# Altium schematic sheet 0248_GPU SPI FLASH CIRC.SchDoc
size 848 x 558 mm
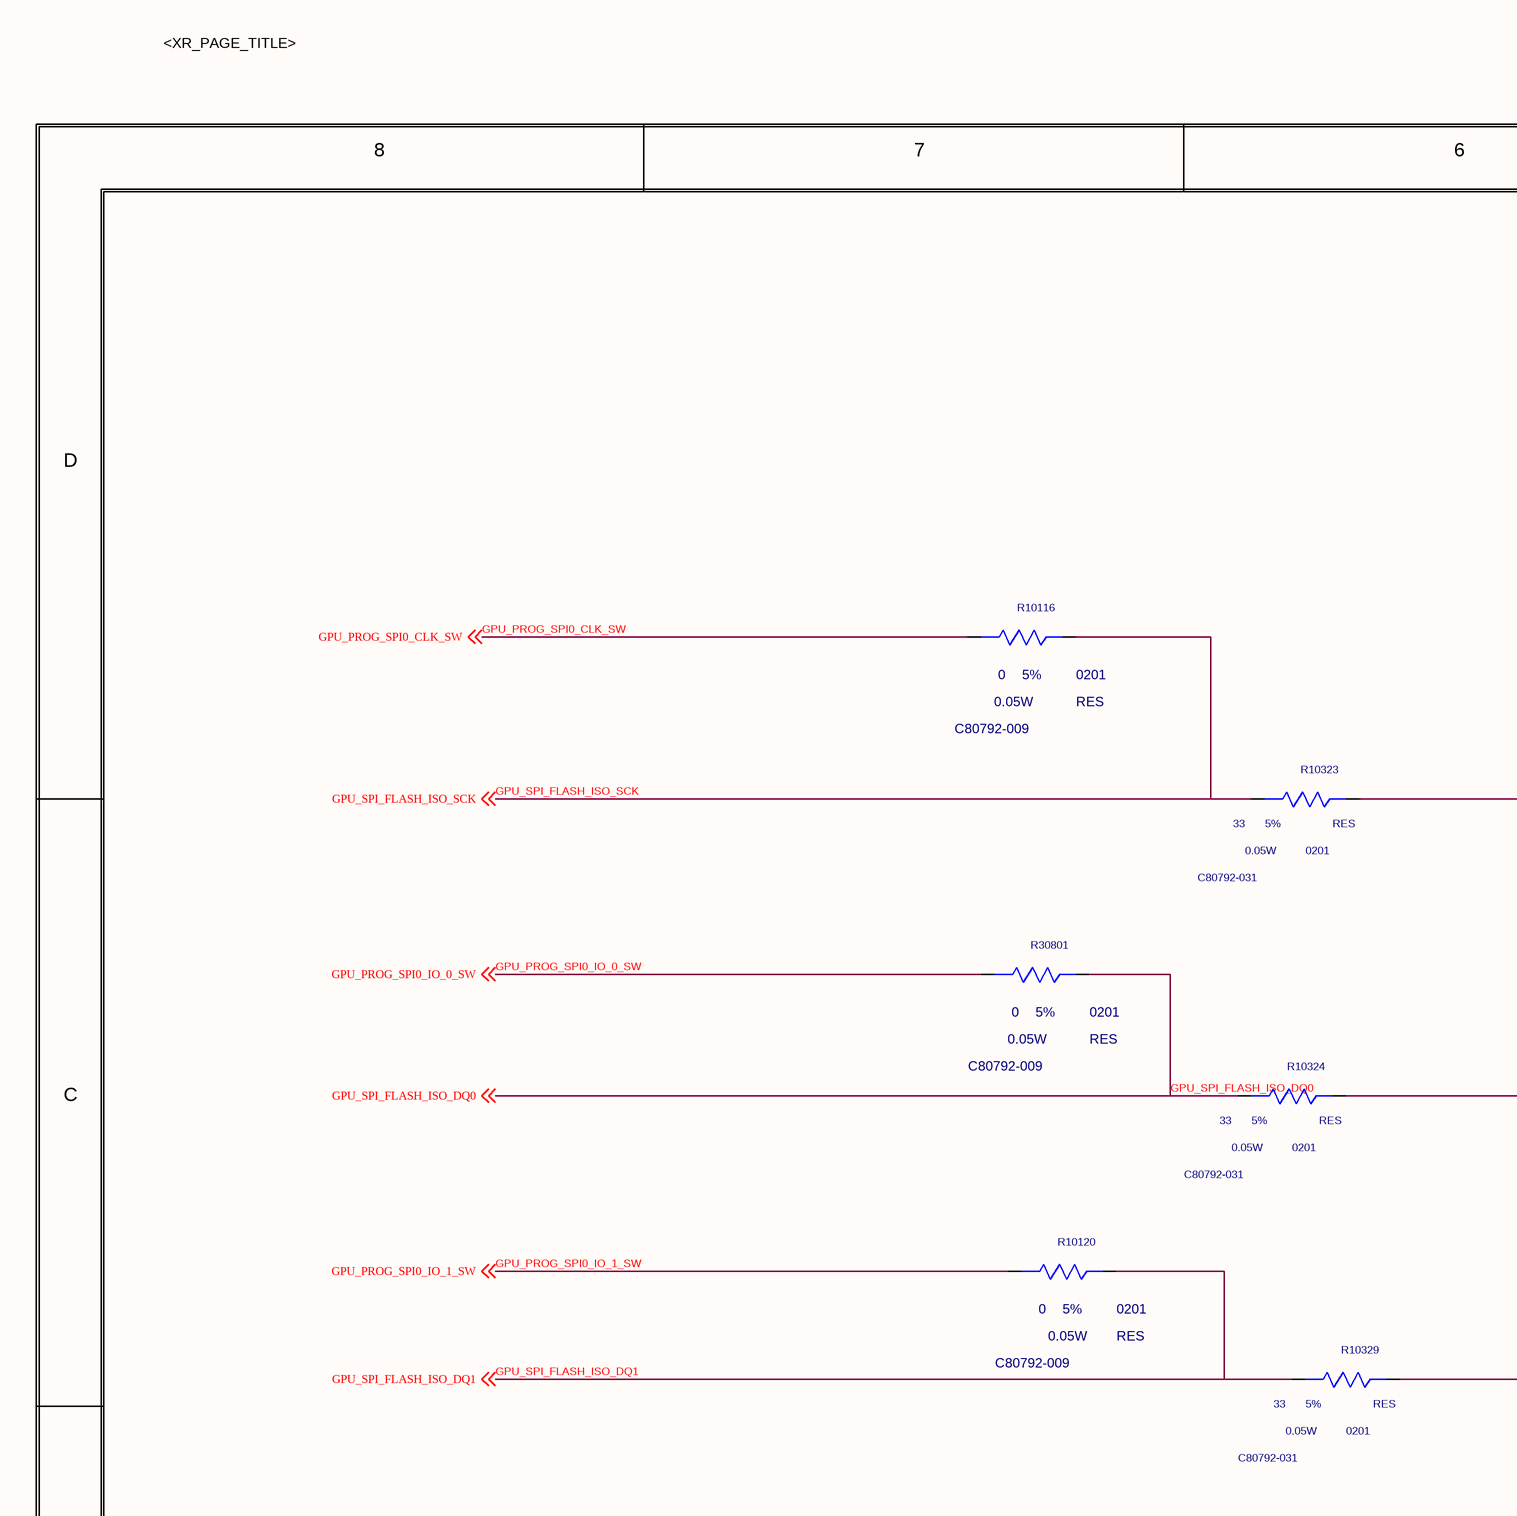
[diagram p0: 0248_GPU SPI FLASH CIRC.SchDoc, top left]
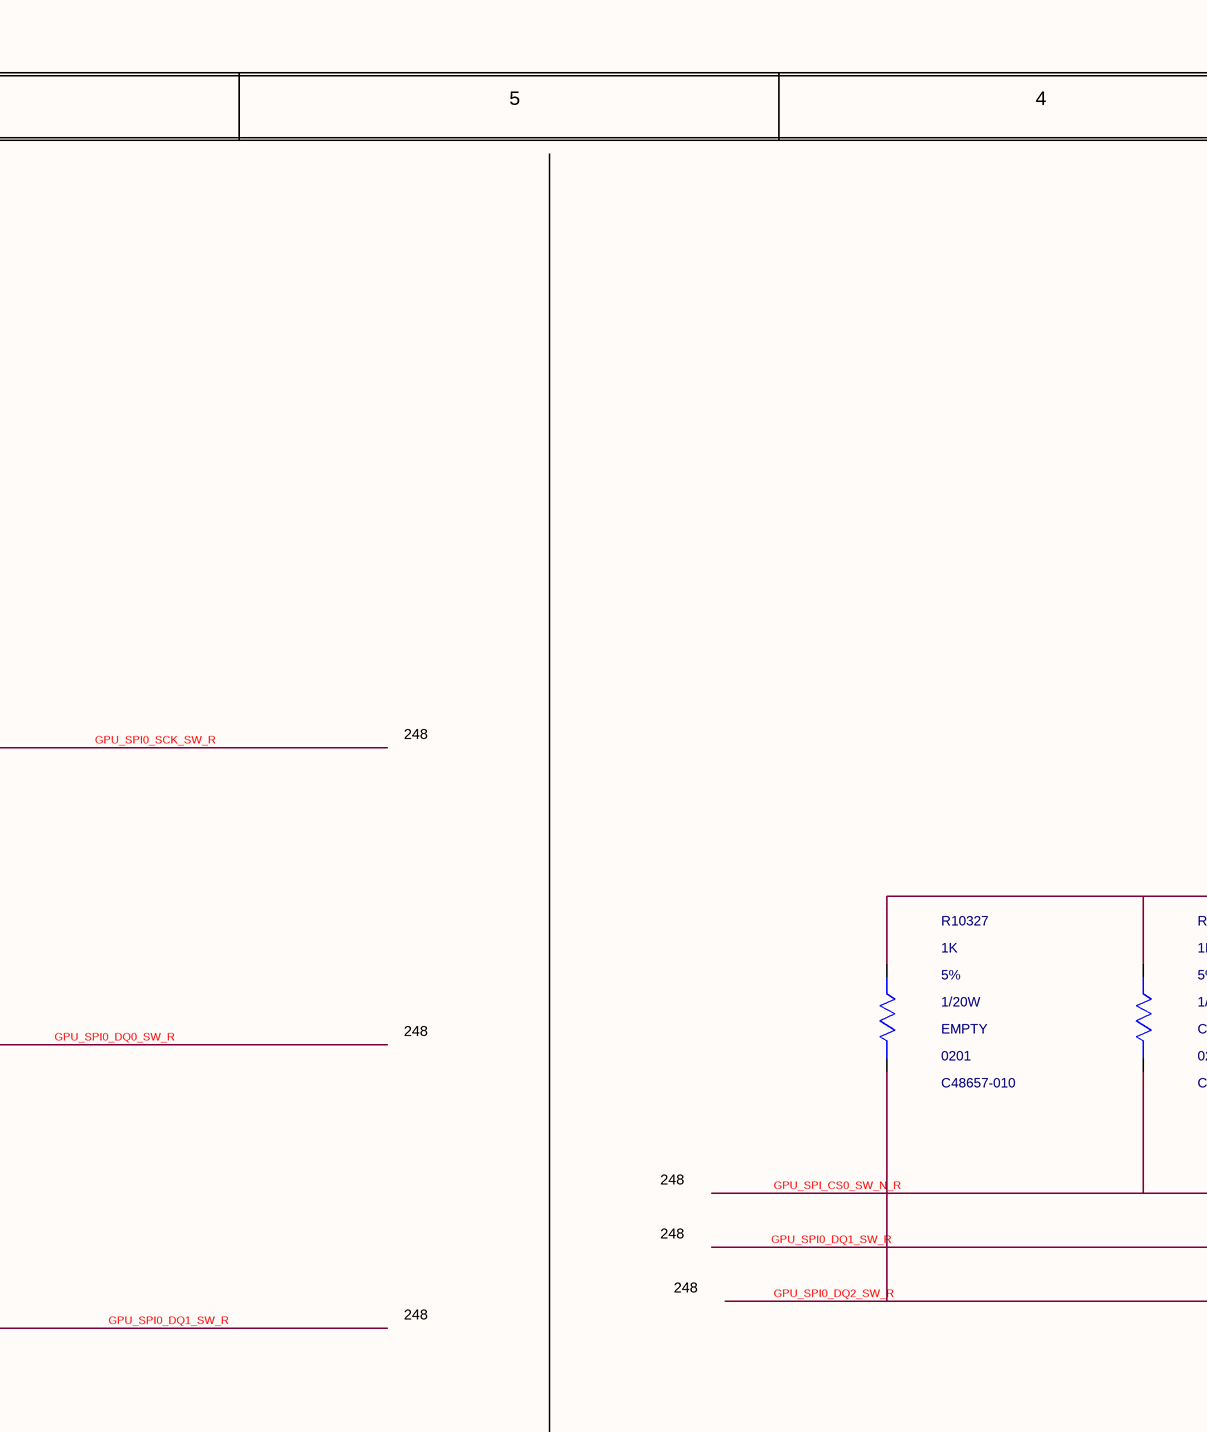
[diagram p1: 0248_GPU SPI FLASH CIRC.SchDoc, top middle]
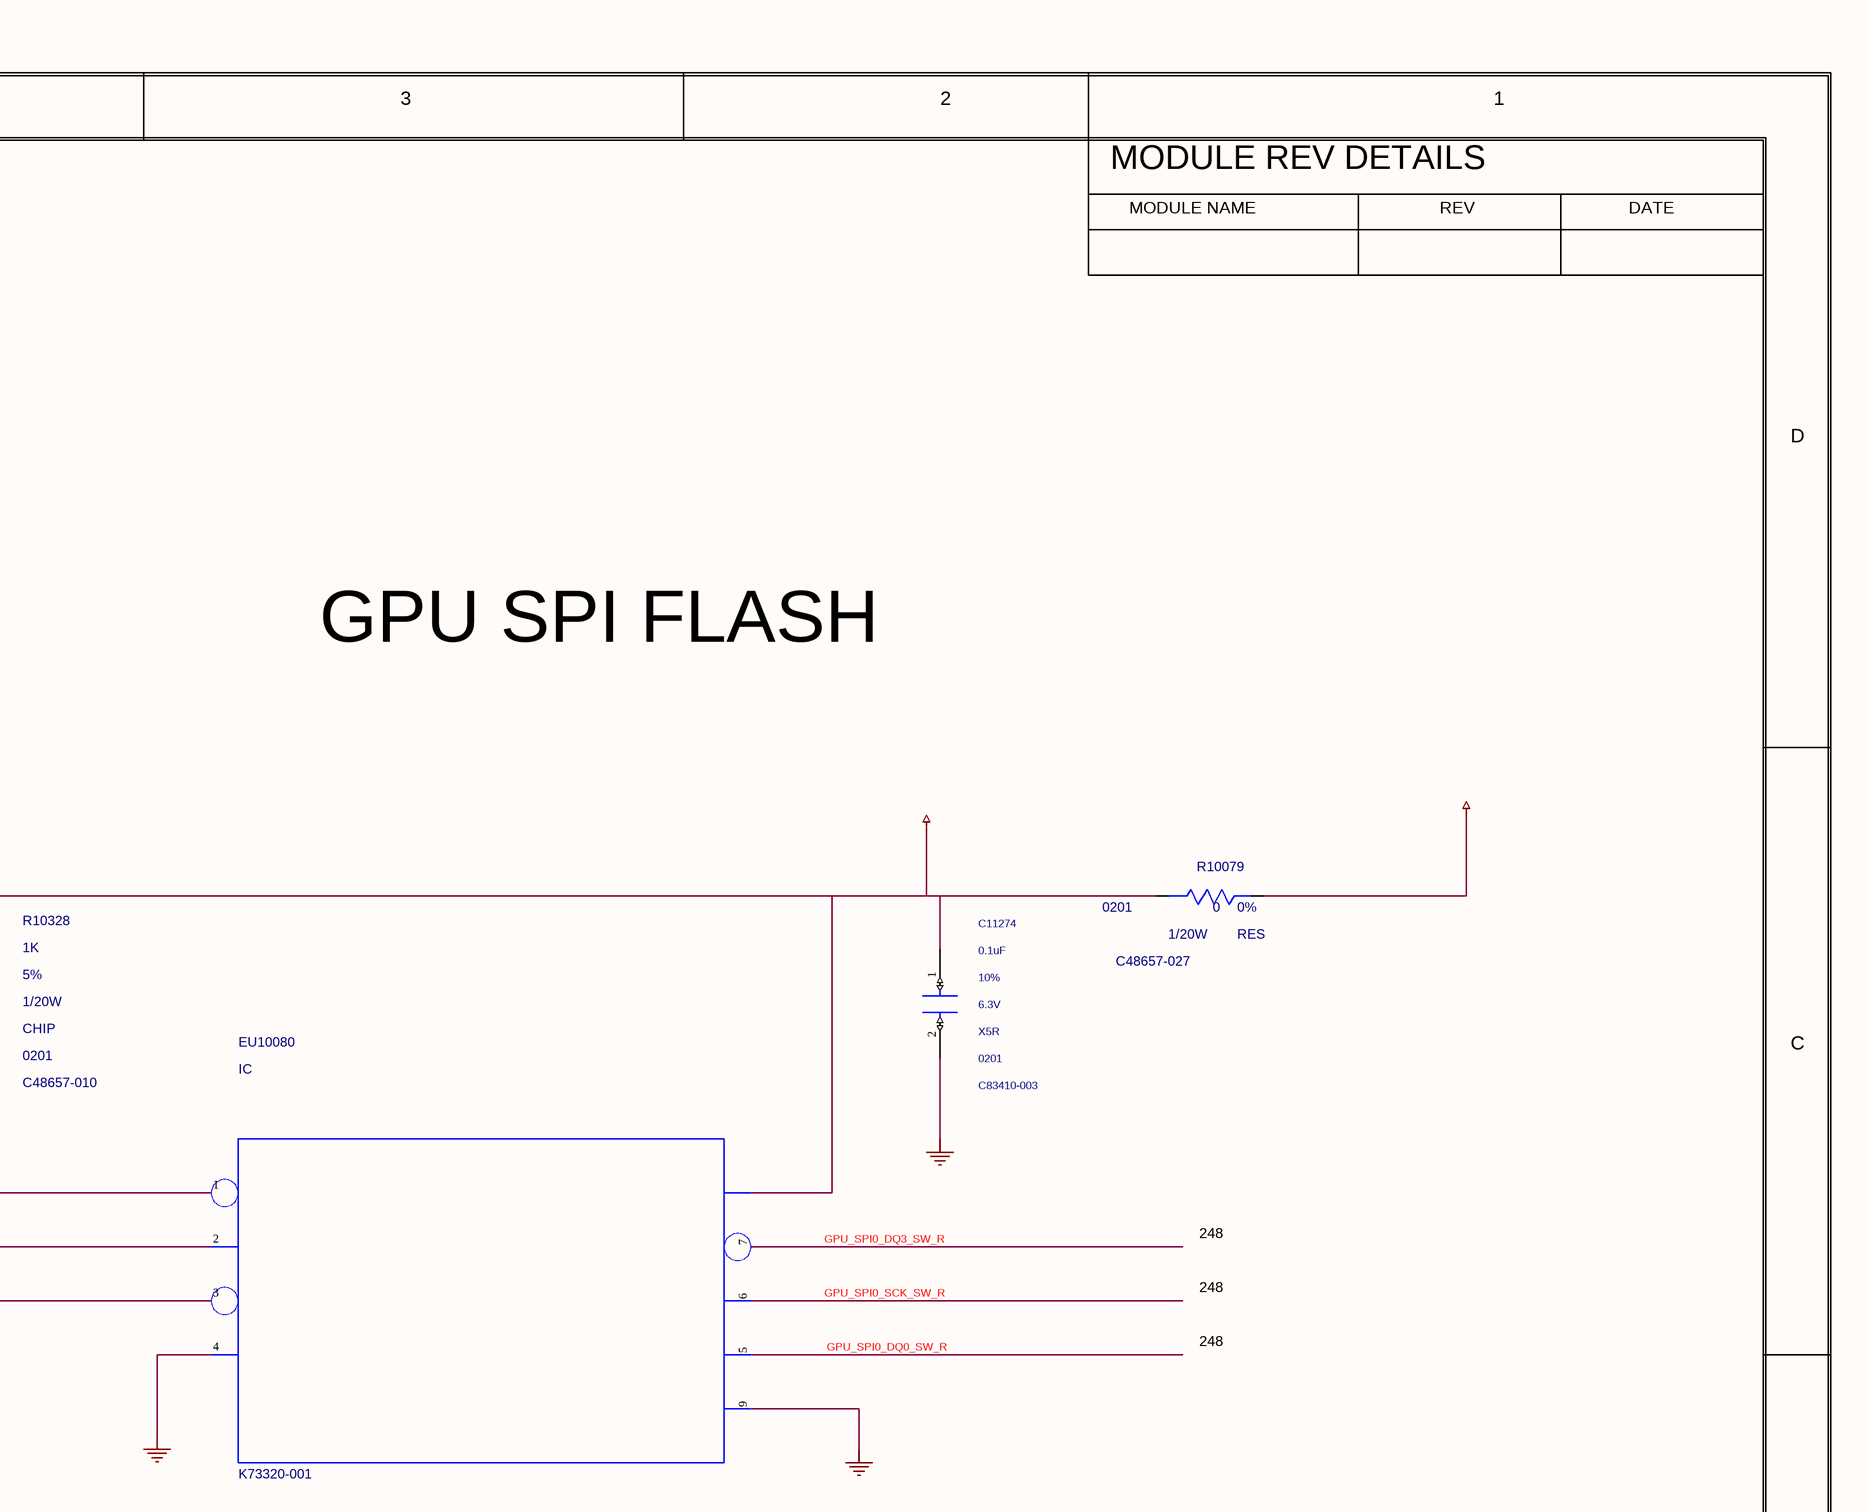
[diagram p2: 0248_GPU SPI FLASH CIRC.SchDoc, top right]
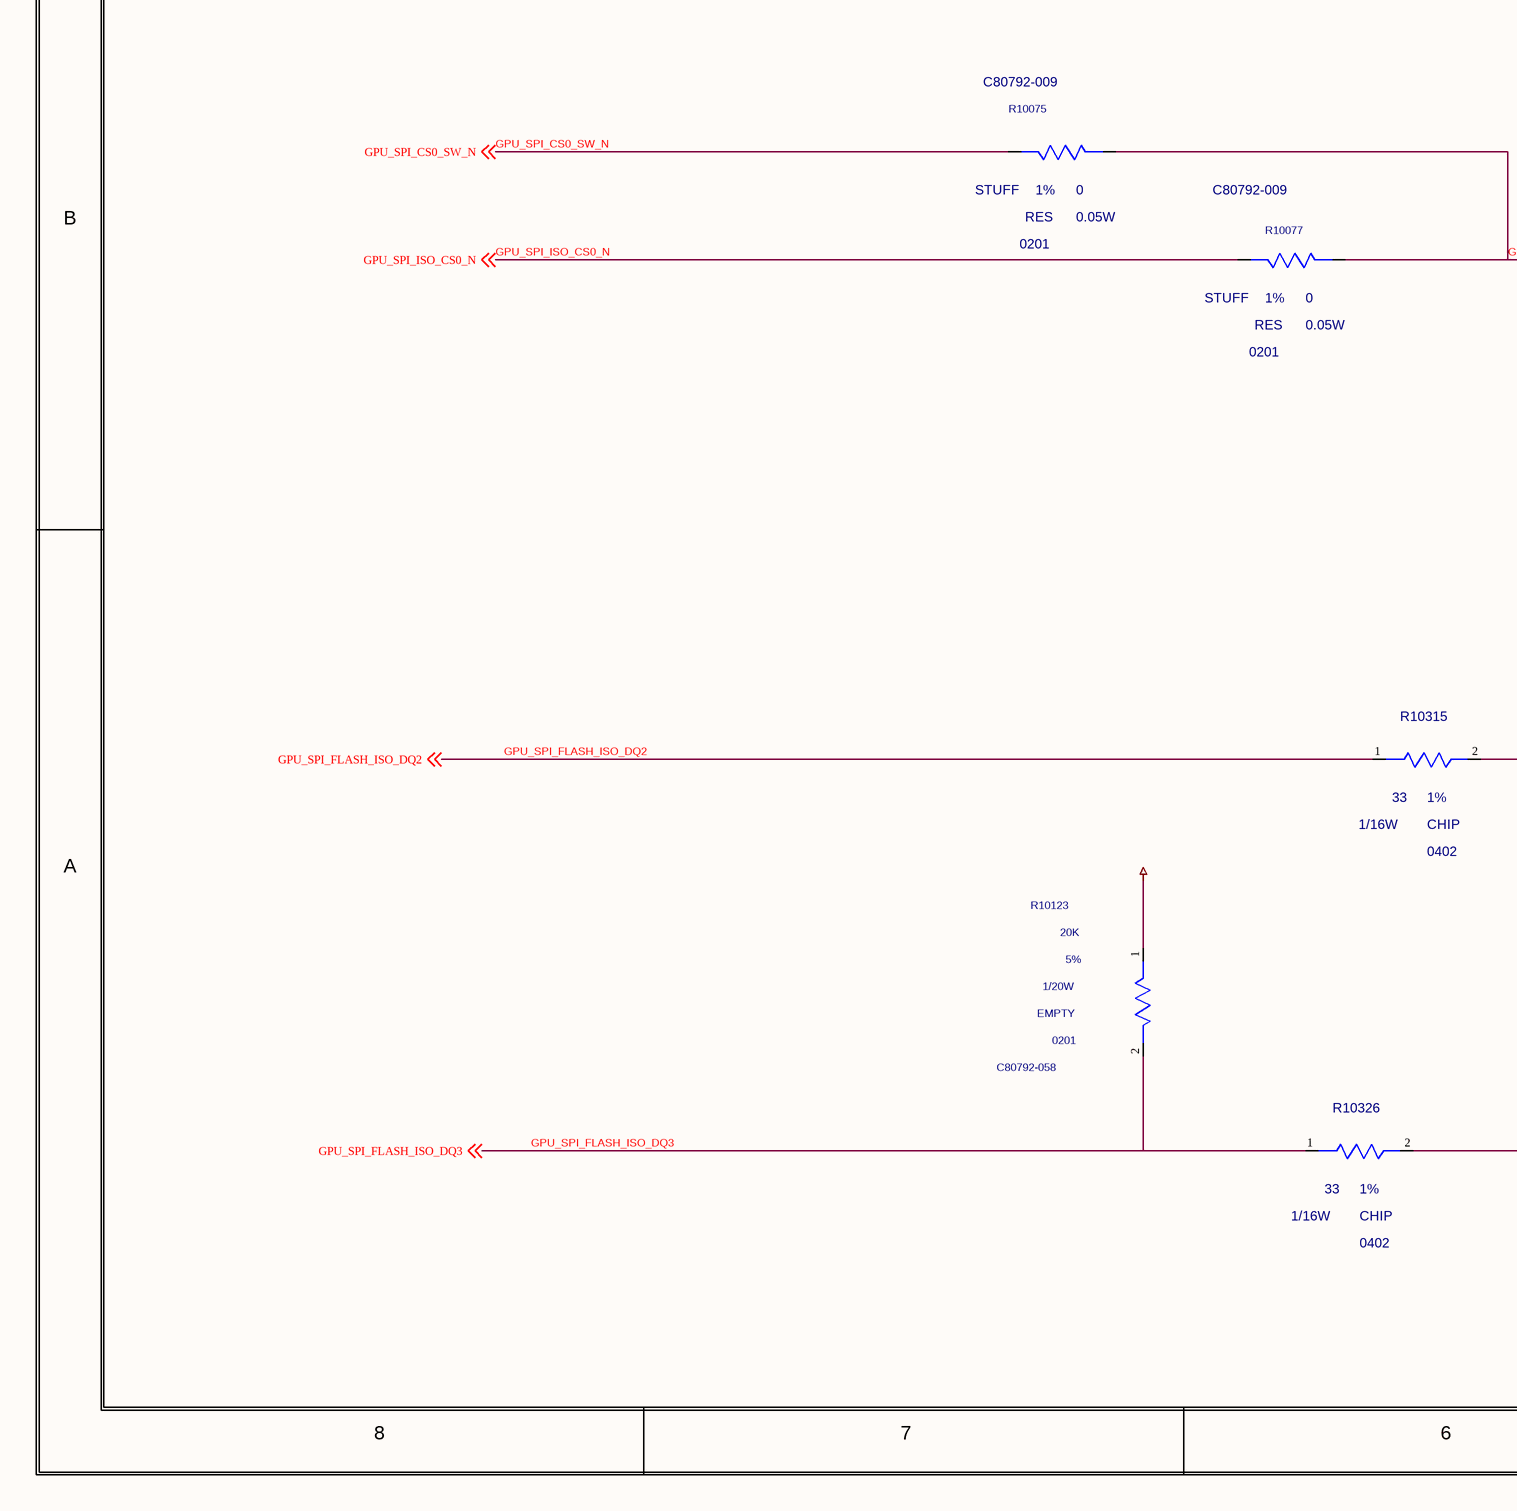
[diagram p3: 0248_GPU SPI FLASH CIRC.SchDoc, bottom left]
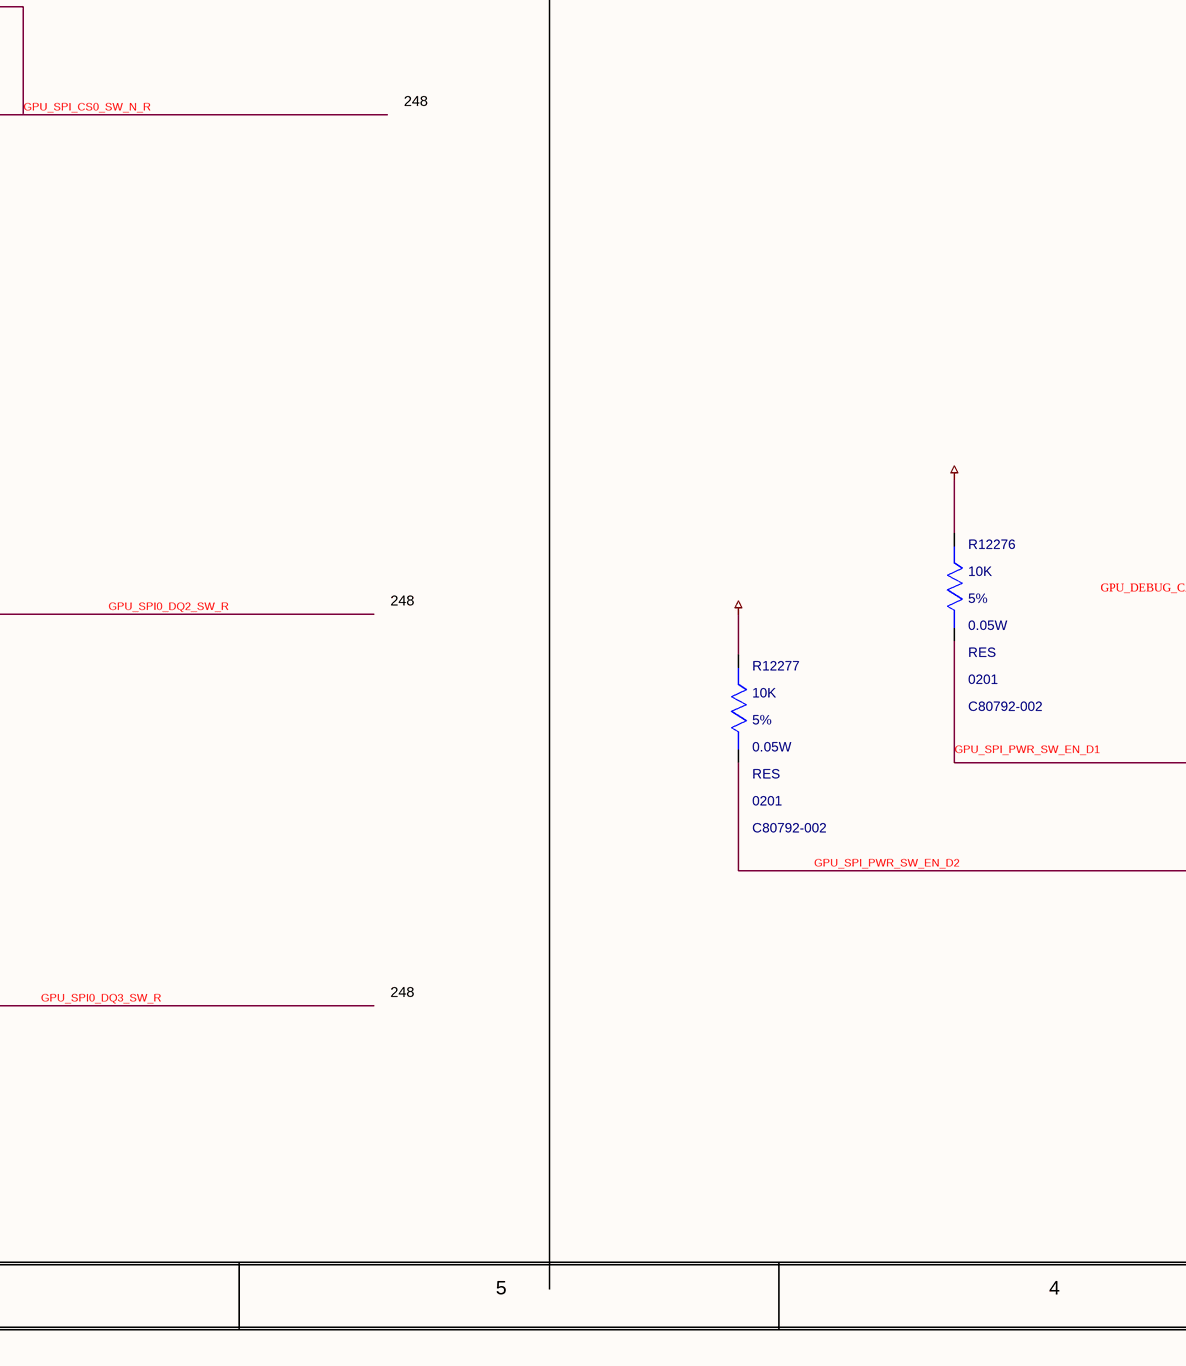
[diagram p4: 0248_GPU SPI FLASH CIRC.SchDoc, bottom middle]
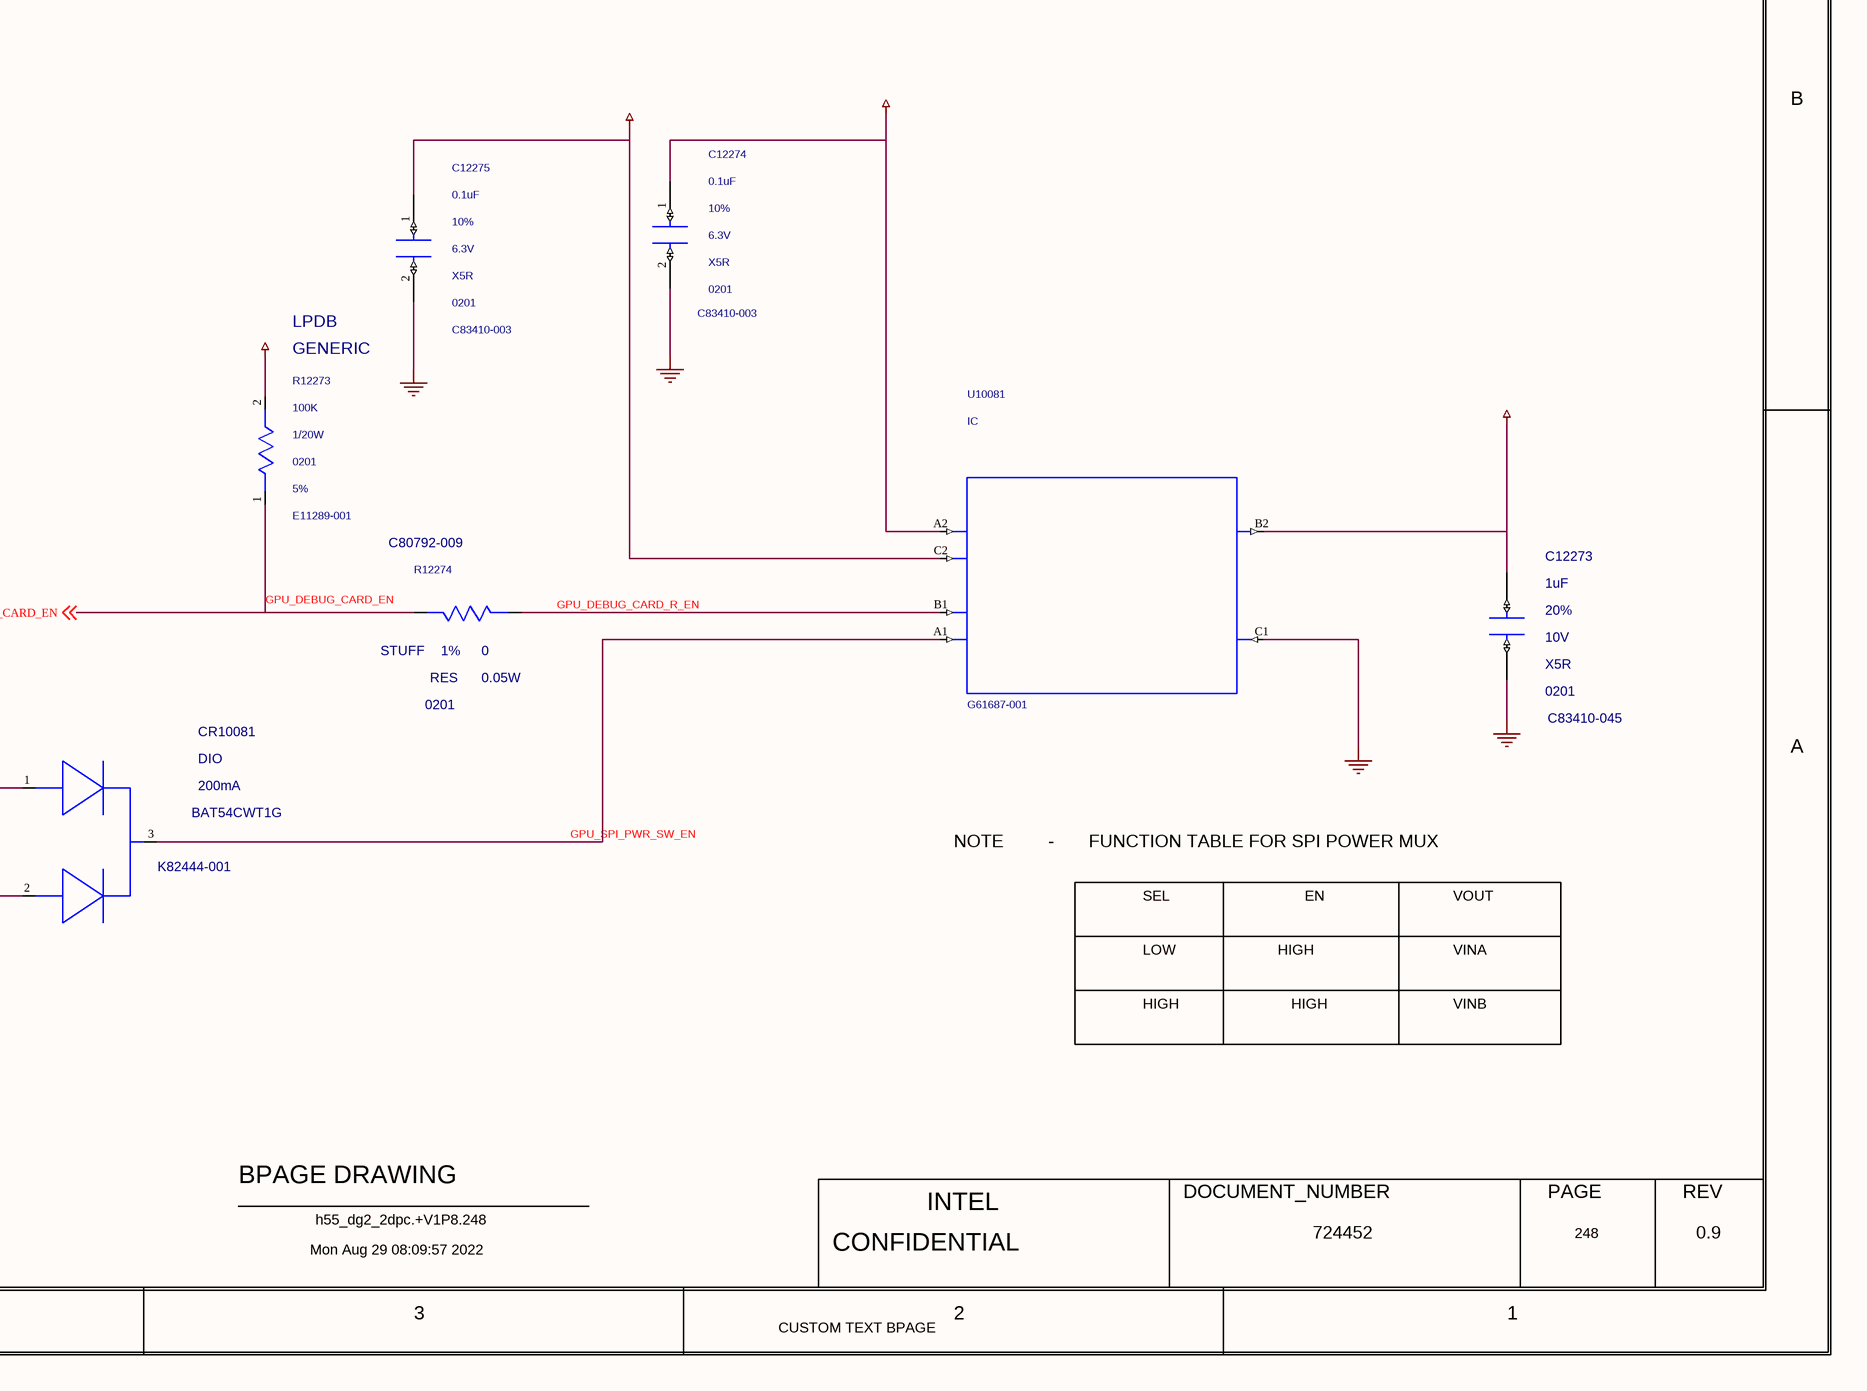
[diagram p5: 0248_GPU SPI FLASH CIRC.SchDoc, bottom right]

## Parts
C11274  0.1uF  MATERIAL: X5R  PACK_TYPE: 0201  PART_NUMBER: C83410-003  TOLERANCE: 10%  VOLTAGE: 6.3V  [SMC0201IA]
C12273  1uF  MATERIAL: X5R  PACK_TYPE: 0201  PART_NUMBER: C83410-045  TOLERANCE: 20%  VOLTAGE: 10V  [TK0_SM0201_690X390_MA]
C12274  0.1uF  MATERIAL: X5R  PACK_TYPE: 0201  PART_NUMBER: C83410-003  TOLERANCE: 10%  VOLTAGE: 6.3V  [SMC0201IA]
C12275  0.1uF  MATERIAL: X5R  PACK_TYPE: 0201  PART_NUMBER: C83410-003  TOLERANCE: 10%  VOLTAGE: 6.3V  [SMC0201IA]
CR10081  BAT54CWT1G  CURRENT: 200mA  MATERIAL: DIO  PART_NUMBER: K82444-001  [TK0_SOT323_3_1350X2200_650_MB]
EU10080  MATERIAL: IC  PART_NUMBER: K73320-001  [TK0_LCC8_6100X5100_1270_DF3400X4300_MC]  (hidden comment: W25Q64JW_2)
R10075  0  BOM_USE: STUFF  MATERIAL: RES  PACK_TYPE: 0201  PART_NUMBER: C80792-009  TOLERANCE: 1%  WATTAGE: 0.05W  [TK0_SM0201_630X330_MC]
R10077  0  BOM_USE: STUFF  MATERIAL: RES  PACK_TYPE: 0201  PART_NUMBER: C80792-009  TOLERANCE: 1%  WATTAGE: 0.05W  [TK0_SM0201_630X330_MC]
R10079  0  MATERIAL: RES  PACK_TYPE: 0201  PART_NUMBER: C48657-027  TOLERANCE: 0%  WATTAGE: 1/20W  [TK0_SM0201_630X330_MB]
R10116  0  MATERIAL: RES  PACK_TYPE: 0201  PART_NUMBER: C80792-009  TOLERANCE: 5%  WATTAGE: 0.05W  [CTK0_SM0201_630X330_MA]
R10120  0  MATERIAL: RES  PACK_TYPE: 0201  PART_NUMBER: C80792-009  TOLERANCE: 5%  WATTAGE: 0.05W  [CTK0_SM0201_630X330_MA]
R10123  20K  MATERIAL: EMPTY  PACK_TYPE: 0201  PART_NUMBER: C80792-058  TOLERANCE: 5%  WATTAGE: 1/20W  [SMR0201IA]
R10315  33  MATERIAL: CHIP  PACK_TYPE: 0402  TOLERANCE: 1%  WATTAGE: 1/16W  [SMR0402IA]
R10323  33  MATERIAL: RES  PACK_TYPE: 0201  PART_NUMBER: C80792-031  TOLERANCE: 5%  WATTAGE: 0.05W  [CTK0_SM0201_630X330_MA]
R10324  33  MATERIAL: RES  PACK_TYPE: 0201  PART_NUMBER: C80792-031  TOLERANCE: 5%  WATTAGE: 0.05W  [CTK0_SM0201_630X330_MA]
R10326  33  MATERIAL: CHIP  PACK_TYPE: 0402  TOLERANCE: 1%  WATTAGE: 1/16W  [SMR0402IA]
R10327  1K  MATERIAL: EMPTY  PACK_TYPE: 0201  PART_NUMBER: C48657-010  TOLERANCE: 5%  WATTAGE: 1/20W  [TK2_SM0201_630X330_MA]
R10328  1K  MATERIAL: CHIP  PACK_TYPE: 0201  PART_NUMBER: C48657-010  TOLERANCE: 5%  WATTAGE: 1/20W  [TK2_SM0201_630X330_MA]
R10329  33  MATERIAL: RES  PACK_TYPE: 0201  PART_NUMBER: C80792-031  TOLERANCE: 5%  WATTAGE: 0.05W  [CTK0_SM0201_630X330_MA]
R12273  100K  PACK_TYPE: 0201  PART_NUMBER: E11289-001  TOLERANCE: 5%  WATTAGE: 1/20W  IP: GENERIC  FP_TECH: LPDB  [SMR0201IA]
R12274  0  BOM_USE: STUFF  MATERIAL: RES  PACK_TYPE: 0201  PART_NUMBER: C80792-009  TOLERANCE: 1%  WATTAGE: 0.05W  [TK0_SM0201_630X330_MC]
R12276  10K  MATERIAL: RES  PACK_TYPE: 0201  PART_NUMBER: C80792-002  TOLERANCE: 5%  WATTAGE: 0.05W  [TK0_SM0201_630X330_ME]
R12277  10K  MATERIAL: RES  PACK_TYPE: 0201  PART_NUMBER: C80792-002  TOLERANCE: 5%  WATTAGE: 0.05W  [TK0_SM0201_630X330_ME]
R30801  0  MATERIAL: RES  PACK_TYPE: 0201  PART_NUMBER: C80792-009  TOLERANCE: 5%  WATTAGE: 0.05W  [CTK0_SM0201_630X330_MA]
U10081  MATERIAL: IC  PART_NUMBER: G61687-001  [BGA6_1_50MC]  (hidden comment: FPF1320)

## Nets
+V1P8A_SPI: C12273.1(A) R10079.2(B) U10081.B2(VOUT)
+V1P8A_SPI_FLASH_GPU: C11274.1(A) R10079.1(A) R10123.1(A) R10327.1(A) R10328.1(A)
+V1P8S_GPU: C12275.1(A) R12273.2(B) R12276.1(A) U10081.C2(VINB)
+VPROG_1P8A_CONN_GPU: C12274.1(A) R12277.1(A) U10081.A2(VINA)
GND: C11274.2(B) C12273.2(B) C12274.2(B) C12275.2(B) EU10080.4(GND) EU10080.9(THPAD) U10081.C1(GND)
VCC: EU10080.8(VCC)
GPU_DEBUG_CARD_EN: R12273.1(A) R12274.2(B) ; off-sheet GPU_DEBUG_CARD_EN
GPU_DEBUG_CARD_R_EN: R12274.1(A) U10081.B1(SEL)
GPU_PROG_SPI0_CLK_SW: R10116.1(A) ; off-sheet GPU_PROG_SPI0_CLK_SW
GPU_PROG_SPI0_IO_0_SW: R30801.1(A) ; off-sheet GPU_PROG_SPI0_IO_0_SW
GPU_PROG_SPI0_IO_1_SW: R10120.1(A) ; off-sheet GPU_PROG_SPI0_IO_1_SW
GPU_SPI0_DQ0_SW_R: EU10080.5(DI_IO0) R10324.2(B)
GPU_SPI0_DQ1_SW_R: EU10080.2(DO_IO1) R10329.2(B)
GPU_SPI0_DQ2_SW_R: EU10080.3(WP_N_IO2) R10315.2(B) R10327.2(B)
GPU_SPI0_DQ3_SW_R: EU10080.7(HOLD_N_RESET_N_IO3) R10326.2(B)
GPU_SPI0_SCK_SW_R: EU10080.6(CLK) R10323.2(B)
GPU_SPI_CS0_SW_N: R10075.2(B) ; off-sheet GPU_SPI_CS0_SW_N
GPU_SPI_CS0_SW_N_R: EU10080.1(CS_N) R10075.1(A) R10077.1(A) R10328.2(B)
GPU_SPI_FLASH_ISO_DQ0: R10324.1(A) R30801.2(B) ; off-sheet GPU_SPI_FLASH_ISO_DQ0
GPU_SPI_FLASH_ISO_DQ1: R10120.2(B) R10329.1(A) ; off-sheet GPU_SPI_FLASH_ISO_DQ1
GPU_SPI_FLASH_ISO_DQ2: R10315.1(A) ; off-sheet GPU_SPI_FLASH_ISO_DQ2
GPU_SPI_FLASH_ISO_DQ3: R10123.2(B) R10326.1(A) ; off-sheet GPU_SPI_FLASH_ISO_DQ3
GPU_SPI_FLASH_ISO_SCK: R10116.2(B) R10323.1(A) ; off-sheet GPU_SPI_FLASH_ISO_SCK
GPU_SPI_ISO_CS0_N: R10077.2(B) ; off-sheet GPU_SPI_ISO_CS0_N
GPU_SPI_PWR_SW_EN: CR10081.3(C) U10081.A1(EN)
GPU_SPI_PWR_SW_EN_D1: CR10081.1(A1) R12276.2(B)
GPU_SPI_PWR_SW_EN_D2: CR10081.2(A2) R12277.2(B)

## Notes on the sheet
- <XR_PAGE_TITLE>
- 8
- 7
- 6
- 5
- 4
- 3
- 2
- 1
- MODULE REV DETAILS
- MODULE NAME
- REV
- DATE
- D
- GPU SPI FLASH
- 248
- C
- B
- A
- NOTE
- -
- FUNCTION TABLE FOR SPI POWER MUX
- SEL
- EN
- VOUT
- HIGH
- LOW
- VINA
- VINB
- BPAGE DRAWING
- INTEL
- DOCUMENT_NUMBER
- PAGE
- Mon Aug 29 08:09:57 2022
- h55_dg2_2dpc.+V1P8.248
- CONFIDENTIAL
- 724452
- 0.9
- CUSTOM TEXT BPAGE

## Library data of the parts
C11274 = CAP: CDS_PHYS_PART_NAME: CAP_0201-C83410-003,X5R,0.1UF,6.3V,10%,LPDB,GENERIC; OriginalSymbolOrigin: (-50,25); XY: (-8425,3300); VER: 1; ROT: 0; PHYS_PAGE: 248; LOCATION: C11274; DRAWING: @RVP1_ADL_SB_ADP_S_DDR5_SODIMM_2DPC_LIB.H55_DG2_2DPC(SCH_1):PAGE448; CDS_LIB: discrete; PCB Footprint: SMC0201IA; CHIPS_PART_NAME: CAP; CDS_PART_NAME: CAP_0201-C83410-003,X5R,0.1UF,6.3V,10%,LPDB,GENERIC; CDS_LOCATION: C11274
C12273 = CAP_2: CDS_PHYS_PART_NAME: CAP_2_0201-C83410-045,X5R,1UF,10V,20%,TK0,GENERIC; BOM_USE: STUFF; CDS_LMAN_SYM_OUTLINE: -50,50,50,-50; FP_TECH: TK0; IP: GENERIC; ROOM: NONE; OriginalSymbolOrigin: (-50,25); XY: (-7375,1125); VER: 1; ROT: 0; PHYS_PAGE: 248; LOCATION: C12273; DRAWING: @RVP1_ADL_SB_ADP_S_DDR5_SODIMM_2DPC_LIB.H55_DG2_2DPC(SCH_1):PAGE448; CDS_LIB: discrete_2; VARIANT: ?; PCB Footprint: TK0_SM0201_690X390_MA; CHIPS_PART_NAME: CAP_2; CDS_PART_NAME: CAP_2_0201-C83410-045,X5R,1UF,10V,20%,TK0,GENERIC; CDS_LOCATION: C12273
C12274 = CAP: CDS_PHYS_PART_NAME: CAP_0201-C83410-003,X5R,0.1UF,6.3V,10%,LPDB,GENERIC; OriginalSymbolOrigin: (-50,25); XY: (-8925,1850); VER: 1; ROT: 0; PHYS_PAGE: 248; LOCATION: C12274; DRAWING: @RVP1_ADL_SB_ADP_S_DDR5_SODIMM_2DPC_LIB.H55_DG2_2DPC(SCH_1):PAGE448; CDS_LIB: discrete; PCB Footprint: SMC0201IA; CHIPS_PART_NAME: CAP; CDS_PART_NAME: CAP_0201-C83410-003,X5R,0.1UF,6.3V,10%,LPDB,GENERIC; CDS_LOCATION: C12274
C12275 = CAP: CDS_PHYS_PART_NAME: CAP_0201-C83410-003,X5R,0.1UF,6.3V,10%,LPDB,GENERIC; OriginalSymbolOrigin: (-50,25); XY: (-9400,1825); VER: 1; ROT: 0; PHYS_PAGE: 248; LOCATION: C12275; DRAWING: @RVP1_ADL_SB_ADP_S_DDR5_SODIMM_2DPC_LIB.H55_DG2_2DPC(SCH_1):PAGE448; CDS_LIB: discrete; PCB Footprint: SMC0201IA; CHIPS_PART_NAME: CAP; CDS_PART_NAME: CAP_0201-C83410-003,X5R,0.1UF,6.3V,10%,LPDB,GENERIC; CDS_LOCATION: C12275
CR10081 = BAT54C_2: CDS_PHYS_PART_NAME: BAT54C_2_SOT323-K82444-001,DIO,BAT54CWT1G,200MA,TK0,GENERIC; BOM_USE: STUFF; CDS_LMAN_SYM_OUTLINE: -100,150,50,-150; FP_TECH: TK0; IP: GENERIC; PACK_TYPE: SOT323; ROOM: NONE; OriginalSymbolOrigin: (-125,150); XY: (-9975,725); VER: 1; ROT: 0; PHYS_PAGE: 248; LOCATION: CR10081; DRAWING: @RVP1_ADL_SB_ADP_S_DDR5_SODIMM_2DPC_LIB.H55_DG2_2DPC(SCH_1):PAGE448; CDS_LIB: local; VARIANT: ?; PCB Footprint: TK0_SOT323_3_1350X2200_650_MB; SEC_TYPE: SOT323; CHIPS_PART_NAME: BAT54C_2; CDS_PART_NAME: BAT54C_2_SOT323-K82444-001,DIO,BAT54CWT1G,200MA,TK0,GENERIC; CDS_LOCATION: CR10081
EU10080 = W25Q64JW_2: CDS_PHYS_PART_NAME: W25Q64JW_2_LCC-K73320-001,IC,W25Q64JWZPIQ,TK0,GENERIC; CDS_LMAN_SYM_OUTLINE: -450,300,450,-300; FP_TECH: TK0; IP: GENERIC; PACK_TYPE: LCC; ROOM: NONE; OriginalSymbolOrigin: (-500,300); XY: (-9275,2750); VER: 1; ROT: 0; PHYS_PAGE: 248; LOCATION: EU10080; DRAWING: @RVP1_ADL_SB_ADP_S_DDR5_SODIMM_2DPC_LIB.H55_DG2_2DPC(SCH_1):PAGE448; CDS_LIB: local; VARIANT: ?; PCB Footprint: TK0_LCC8_6100X5100_1270_DF3400X4300_MC; SEC_TYPE: LCC; CHIPS_PART_NAME: W25Q64JW_2; CDS_PART_NAME: W25Q64JW_2_LCC-K73320-001,IC,W25Q64JWZPIQ,TK0,GENERIC; CDS_LOCATION: EU10080
R10075 = RES_2#1: CHIPS_PART_NAME: RES_2; CDS_PHYS_PART_NAME: RES_2_0201-C80792-009,RES,0,1%,0.05W,TK0,GENERIC; CDS_LMAN_SYM_OUTLINE: -50,50,50,-50; FP_TECH: TK0; IP: GENERIC; ROOM: NONE; OriginalSymbolOrigin: (-75,25); XY: (-13125,2225); VER: 1; ROT: 2; PHYS_PAGE: 248; LOCATION: R10075; DRAWING: @RVP1_ADL_SB_ADP_S_DDR5_SODIMM_2DPC_LIB.H55_DG2_2DPC(SCH_1):PAGE448; CDS_LIB: discrete_2; VARIANT: ?; PCB Footprint: TK0_SM0201_630X330_MC; CDS_PART_NAME: RES_2_0201-C80792-009,RES,0,1%,0.05W,TK0,GENERIC; CDS_LOCATION: R10075
R10077 = RES_2#1: CHIPS_PART_NAME: RES_2; CDS_PHYS_PART_NAME: RES_2_0201-C80792-009,RES,0,1%,0.05W,TK0,GENERIC; CDS_LMAN_SYM_OUTLINE: -50,50,50,-50; FP_TECH: TK0; IP: GENERIC; ROOM: NONE; OriginalSymbolOrigin: (-75,25); XY: (-12700,2025); VER: 1; ROT: 2; PHYS_PAGE: 248; LOCATION: R10077; DRAWING: @RVP1_ADL_SB_ADP_S_DDR5_SODIMM_2DPC_LIB.H55_DG2_2DPC(SCH_1):PAGE448; CDS_LIB: discrete_2; VARIANT: ?; PCB Footprint: TK0_SM0201_630X330_MC; CDS_PART_NAME: RES_2_0201-C80792-009,RES,0,1%,0.05W,TK0,GENERIC; CDS_LOCATION: R10077
R10079 = RES_2#1: CHIPS_PART_NAME: RES_2; CDS_PHYS_PART_NAME: RES_2_0201-C48657-027,RES,0,0%,1/20W,TK0,GENERIC; BOM_USE: STUFF; CDS_LMAN_SYM_OUTLINE: -50,50,50,-50; FP_TECH: TK0; IP: GENERIC; ROOM: NONE; OriginalSymbolOrigin: (-75,25); XY: (-7925,3500); VER: 1; PHYS_PAGE: 248; LOCATION: R10079; DRAWING: @RVP1_ADL_SB_ADP_S_DDR5_SODIMM_2DPC_LIB.H55_DG2_2DPC(SCH_1):PAGE448; CDS_LIB: discrete_2; VARIANT: ?; PCB Footprint: TK0_SM0201_630X330_MB; ROT: 0; CDS_PART_NAME: RES_2_0201-C48657-027,RES,0,0%,1/20W,TK0,GENERIC; CDS_LOCATION: R10079
R10116 = C_RES#1: CHIPS_PART_NAME: C_RES; CDS_PHYS_PART_NAME: C_RES_0201-C80792-009,RES,0,5%,0.05W,TK0,GENERIC; CDS_LMAN_SYM_OUTLINE: -50,50,50,-50; FP_TECH: TK0; IP: GENERIC; ROOM: NONE; OriginalSymbolOrigin: (-75,25); XY: (-13200,4075); VER: 1; PHYS_PAGE: 248; LOCATION: R10116; DRAWING: @RVP1_ADL_SB_ADP_S_DDR5_SODIMM_2DPC_LIB.H55_DG2_2DPC(SCH_1):PAGE448; CDS_LIB: c_discrete; VARIANT: ?; PCB Footprint: CTK0_SM0201_630X330_MA; ROT: 0; CDS_PART_NAME: C_RES_0201-C80792-009,RES,0,5%,0.05W,TK0,GENERIC; CDS_LOCATION: R10116
R10120 = C_RES#1: CHIPS_PART_NAME: C_RES; CDS_PHYS_PART_NAME: C_RES_0201-C80792-009,RES,0,5%,0.05W,TK0,GENERIC; CDS_LMAN_SYM_OUTLINE: -50,50,50,-50; FP_TECH: TK0; IP: GENERIC; ROOM: NONE; OriginalSymbolOrigin: (-75,25); XY: (-13125,2900); VER: 1; PHYS_PAGE: 248; LOCATION: R10120; DRAWING: @RVP1_ADL_SB_ADP_S_DDR5_SODIMM_2DPC_LIB.H55_DG2_2DPC(SCH_1):PAGE448; CDS_LIB: c_discrete; VARIANT: ?; PCB Footprint: CTK0_SM0201_630X330_MA; ROT: 0; CDS_PART_NAME: C_RES_0201-C80792-009,RES,0,5%,0.05W,TK0,GENERIC; CDS_LOCATION: R10120
R10123 = RES: CDS_PHYS_PART_NAME: RES_0201-C80792-058,EMPTY,20K,5%,1/20W,LPDB,GENERIC; OriginalSymbolOrigin: (-25,75); XY: (-12975,650); VER: 2; SUB_ROOM_2: PUPD; SUB_ROOM_1: BOOT_FLASH_AP; PHYS_PAGE: 248; LOCATION: R10123; DRAWING: @RVP1_ADL_SB_ADP_S_DDR5_SODIMM_2DPC_LIB.H55_DG2_2DPC(SCH_1):PAGE448; CDS_LIB: discrete; PCB Footprint: SMR0201IA; ROT: 2; CHIPS_PART_NAME: RES; CDS_PART_NAME: RES_0201-C80792-058,EMPTY,20K,5%,1/20W,LPDB,GENERIC; CDS_LOCATION: R10123
R10315 = RES#1: PART_NUMBER: A93548-503; CHIPS_PART_NAME: RES; CDS_PHYS_PART_NAME: RES_0402-A93548-503,CHIP,33,1%,1/16W,LPDB,GENERIC; OriginalSymbolOrigin: (-75,25); XY: (-12450,1100); VER: 1; ROT: 0; PHYS_PAGE: 248; LOCATION: R10315; IP: GENERIC; FP_TECH: LPDB; DRAWING: @RVP1_ADL_SB_ADP_S_DDR5_SODIMM_2DPC_LIB.H55_DG2_2DPC(SCH_1):PAGE448; CDS_LIB: discrete; PCB Footprint: SMR0402IA; CDS_PART_NAME: RES_0402-A93548-503,CHIP,33,1%,1/16W,LPDB,GENERIC; CDS_LOCATION: R10315
R10323 = C_RES#1: CHIPS_PART_NAME: C_RES; CDS_PHYS_PART_NAME: C_RES_0201-C80792-031,RES,33,5%,0.05W,TK0,GENERIC; CDS_LMAN_SYM_OUTLINE: -50,50,50,-50; FP_TECH: TK0; IP: GENERIC; ROOM: NONE; OriginalSymbolOrigin: (-75,25); XY: (-12675,3775); VER: 1; ROT: 0; PHYS_PAGE: 248; LOCATION: R10323; DRAWING: @RVP1_ADL_SB_ADP_S_DDR5_SODIMM_2DPC_LIB.H55_DG2_2DPC(SCH_1):PAGE448; CDS_LIB: c_discrete; VARIANT: ?; PCB Footprint: CTK0_SM0201_630X330_MA; CDS_PART_NAME: C_RES_0201-C80792-031,RES,33,5%,0.05W,TK0,GENERIC; CDS_LOCATION: R10323
R10324 = C_RES#1: CHIPS_PART_NAME: C_RES; CDS_PHYS_PART_NAME: C_RES_0201-C80792-031,RES,33,5%,0.05W,TK0,GENERIC; CDS_LMAN_SYM_OUTLINE: -50,50,50,-50; FP_TECH: TK0; IP: GENERIC; ROOM: NONE; OriginalSymbolOrigin: (-75,25); XY: (-12700,3225); VER: 1; ROT: 0; PHYS_PAGE: 248; LOCATION: R10324; DRAWING: @RVP1_ADL_SB_ADP_S_DDR5_SODIMM_2DPC_LIB.H55_DG2_2DPC(SCH_1):PAGE448; CDS_LIB: c_discrete; VARIANT: ?; PCB Footprint: CTK0_SM0201_630X330_MA; CDS_PART_NAME: C_RES_0201-C80792-031,RES,33,5%,0.05W,TK0,GENERIC; CDS_LOCATION: R10324
R10326 = RES#1: PART_NUMBER: A93548-503; CHIPS_PART_NAME: RES; CDS_PHYS_PART_NAME: RES_0402-A93548-503,CHIP,33,1%,1/16W,LPDB,GENERIC; OriginalSymbolOrigin: (-75,25); XY: (-12575,375); VER: 1; ROT: 0; PHYS_PAGE: 248; LOCATION: R10326; IP: GENERIC; FP_TECH: LPDB; DRAWING: @RVP1_ADL_SB_ADP_S_DDR5_SODIMM_2DPC_LIB.H55_DG2_2DPC(SCH_1):PAGE448; CDS_LIB: discrete; PCB Footprint: SMR0402IA; CDS_PART_NAME: RES_0402-A93548-503,CHIP,33,1%,1/16W,LPDB,GENERIC; CDS_LOCATION: R10326
R10327 = RES_2: CDS_PHYS_PART_NAME: RES_2_0201-C48657-010,EMPTY,1K,5%,1/20W,TK2,GENERIC; BOM_USE: STUFF; CDS_LMAN_SYM_OUTLINE: -50,50,50,-50; FP_TECH: TK2; IP: GENERIC; ROOM: NONE; OriginalSymbolOrigin: (-25,75); XY: (-10700,3275); VER: 2; ROT: 0; PHYS_PAGE: 248; LOCATION: R10327; DRAWING: @RVP1_ADL_SB_ADP_S_DDR5_SODIMM_2DPC_LIB.H55_DG2_2DPC(SCH_1):PAGE448; CDS_LIB: discrete_2; VARIANT: ?; PCB Footprint: TK2_SM0201_630X330_MA; CHIPS_PART_NAME: RES_2; CDS_PART_NAME: RES_2_0201-C48657-010,EMPTY,1K,5%,1/20W,TK2,GENERIC; CDS_LOCATION: R10327
R10328 = RES_2: CDS_PHYS_PART_NAME: RES_2_0201-C48657-010,CHIP,1K,5%,1/20W,TK2,GENERIC; BOM_USE: STUFF; CDS_LMAN_SYM_OUTLINE: -50,50,50,-50; FP_TECH: TK2; IP: GENERIC; ROOM: NONE; OriginalSymbolOrigin: (-25,75); XY: (-10225,3275); VER: 2; ROT: 0; PHYS_PAGE: 248; LOCATION: R10328; DRAWING: @RVP1_ADL_SB_ADP_S_DDR5_SODIMM_2DPC_LIB.H55_DG2_2DPC(SCH_1):PAGE448; CDS_LIB: discrete_2; VARIANT: ?; PCB Footprint: TK2_SM0201_630X330_MA; CHIPS_PART_NAME: RES_2; CDS_PART_NAME: RES_2_0201-C48657-010,CHIP,1K,5%,1/20W,TK2,GENERIC; CDS_LOCATION: R10328
R10329 = C_RES#1: CHIPS_PART_NAME: C_RES; CDS_PHYS_PART_NAME: C_RES_0201-C80792-031,RES,33,5%,0.05W,TK0,GENERIC; CDS_LMAN_SYM_OUTLINE: -50,50,50,-50; FP_TECH: TK0; IP: GENERIC; ROOM: NONE; OriginalSymbolOrigin: (-75,25); XY: (-12600,2700); VER: 1; ROT: 0; PHYS_PAGE: 248; LOCATION: R10329; DRAWING: @RVP1_ADL_SB_ADP_S_DDR5_SODIMM_2DPC_LIB.H55_DG2_2DPC(SCH_1):PAGE448; CDS_LIB: c_discrete; VARIANT: ?; PCB Footprint: CTK0_SM0201_630X330_MA; CDS_PART_NAME: C_RES_0201-C80792-031,RES,33,5%,0.05W,TK0,GENERIC; CDS_LOCATION: R10329
R12273 = RES#1: CHIPS_PART_NAME: RES; CDS_PHYS_PART_NAME: RES_0201-E11289-001,CHIP,100K,5%,1/20W,LPDB,GENERIC; OriginalSymbolOrigin: (-75,25); XY: (-9675,1450); VER: 1; PHYS_PAGE: 248; LOCATION: R12273; DRAWING: @RVP1_ADL_SB_ADP_S_DDR5_SODIMM_2DPC_LIB.H55_DG2_2DPC(SCH_1):PAGE448; CDS_LIB: discrete; MATERIAL: CHIP; PCB Footprint: SMR0201IA; ROT: 1; CDS_PART_NAME: RES_0201-E11289-001,CHIP,100K,5%,1/20W,LPDB,GENERIC; CDS_LOCATION: R12273
R12274 = RES_2#1: CHIPS_PART_NAME: RES_2; CDS_PHYS_PART_NAME: RES_2_0201-C80792-009,RES,0,1%,0.05W,TK0,GENERIC; CDS_LMAN_SYM_OUTLINE: -50,50,50,-50; FP_TECH: TK0; IP: GENERIC; ROOM: NONE; OriginalSymbolOrigin: (-75,25); XY: (-9300,1150); VER: 1; ROT: 2; PHYS_PAGE: 248; LOCATION: R12274; DRAWING: @RVP1_ADL_SB_ADP_S_DDR5_SODIMM_2DPC_LIB.H55_DG2_2DPC(SCH_1):PAGE448; CDS_LIB: discrete_2; VARIANT: ?; PCB Footprint: TK0_SM0201_630X330_MC; CDS_PART_NAME: RES_2_0201-C80792-009,RES,0,1%,0.05W,TK0,GENERIC; CDS_LOCATION: R12274
R12276 = RES_2: CDS_PHYS_PART_NAME: RES_2_0201-C80792-002,RES,10K,5%,0.05W,TK0,GENERIC; BOM_USE: STUFF; CDS_LMAN_SYM_OUTLINE: -50,50,50,-50; FP_TECH: TK0; IP: GENERIC; ROOM: NONE; OriginalSymbolOrigin: (-25,75); XY: (-10575,1150); VER: 2; ROT: 0; PHYS_PAGE: 248; LOCATION: R12276; DRAWING: @RVP1_ADL_SB_ADP_S_DDR5_SODIMM_2DPC_LIB.H55_DG2_2DPC(SCH_1):PAGE448; CDS_LIB: discrete_2; VARIANT: ?; PCB Footprint: TK0_SM0201_630X330_ME; CHIPS_PART_NAME: RES_2; CDS_PART_NAME: RES_2_0201-C80792-002,RES,10K,5%,0.05W,TK0,GENERIC; CDS_LOCATION: R12276
R12277 = RES_2: CDS_PHYS_PART_NAME: RES_2_0201-C80792-002,RES,10K,5%,0.05W,TK0,GENERIC; BOM_USE: STUFF; CDS_LMAN_SYM_OUTLINE: -50,50,50,-50; FP_TECH: TK0; IP: GENERIC; ROOM: NONE; OriginalSymbolOrigin: (-25,75); XY: (-10975,925); VER: 2; ROT: 0; PHYS_PAGE: 248; LOCATION: R12277; DRAWING: @RVP1_ADL_SB_ADP_S_DDR5_SODIMM_2DPC_LIB.H55_DG2_2DPC(SCH_1):PAGE448; CDS_LIB: discrete_2; VARIANT: ?; PCB Footprint: TK0_SM0201_630X330_ME; CHIPS_PART_NAME: RES_2; CDS_PART_NAME: RES_2_0201-C80792-002,RES,10K,5%,0.05W,TK0,GENERIC; CDS_LOCATION: R12277
R30801 = C_RES#1: CHIPS_PART_NAME: C_RES; CDS_PHYS_PART_NAME: C_RES_0201-C80792-009,RES,0,5%,0.05W,TK0,GENERIC; CDS_LMAN_SYM_OUTLINE: -50,50,50,-50; FP_TECH: TK0; IP: GENERIC; ROOM: NONE; OriginalSymbolOrigin: (-75,25); XY: (-13175,3450); VER: 1; PHYS_PAGE: 248; LOCATION: R30801; DRAWING: @RVP1_ADL_SB_ADP_S_DDR5_SODIMM_2DPC_LIB.H55_DG2_2DPC(SCH_1):PAGE448; CDS_LIB: c_discrete; VARIANT: ?; PCB Footprint: CTK0_SM0201_630X330_MA; ROT: 0; CDS_PART_NAME: C_RES_0201-C80792-009,RES,0,5%,0.05W,TK0,GENERIC; CDS_LOCATION: R30801
U10081 = FPF1320: CDS_PHYS_PART_NAME: FPF1320_SM-G61687-001,IC,FPF1320,LPDB,GENERIC; CDS_LMAN_SYM_OUTLINE: -250,200,250,-200; FP_TECH: LPDB; IP: GENERIC; PACK_TYPE: SM; ROOM: NONE; OriginalSymbolOrigin: (-275,200); XY: (-8125,1200); VER: 1; ROT: 0; PHYS_PAGE: 248; LOCATION: U10081; DRAWING: @RVP1_ADL_SB_ADP_S_DDR5_SODIMM_2DPC_LIB.H55_DG2_2DPC(SCH_1):PAGE448; CDS_LIB: local; VARIANT: ?; PCB Footprint: BGA6_1_50MC; CHIPS_PART_NAME: FPF1320; CDS_PART_NAME: FPF1320_SM-G61687-001,IC,FPF1320,LPDB,GENERIC; CDS_LOCATION: U10081